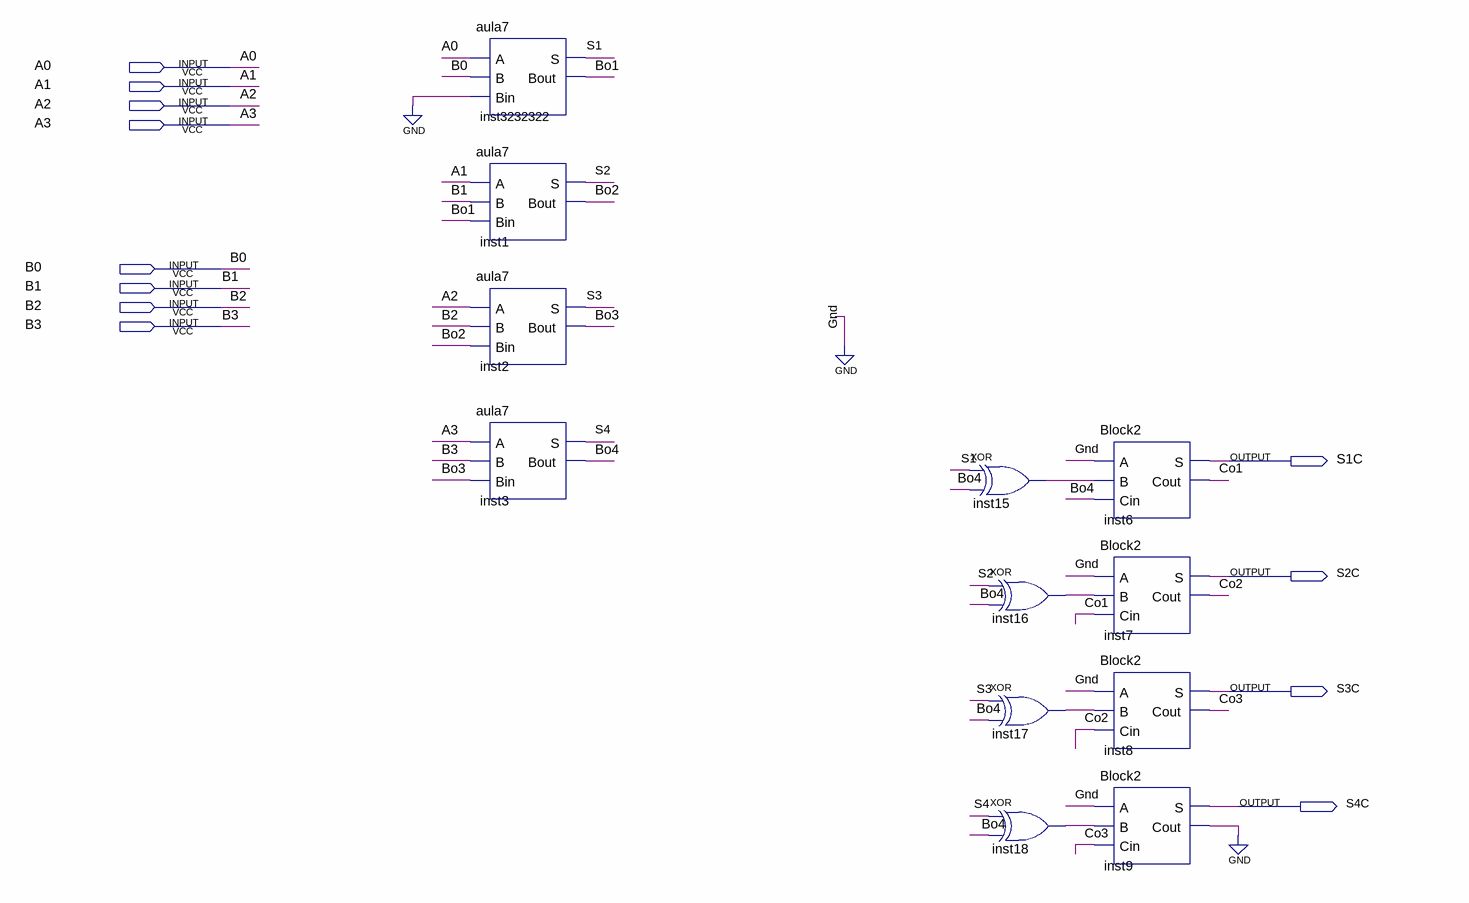
[diagram p0: schematic sheet]
// Quartus schematic aula8.bdf as structural Verilog: 12 symbols, 12 pins
module aula8 (
  input  A0,
  input  A1,
  input  A2,
  input  A3,
  input  B0,
  input  B1,
  input  B2,
  input  B3,
  output S1C,
  output S2C,
  output S3C,
  output S4C
);

  wire Bo1, Bo2, Bo3, Bo4, Co1, Co2, Co3, inst9_cout, inst15_out, inst16_out, inst17_out, inst18_out, S1, S2,
       S3, S4;

  aula7 inst3232322 (.A(A0), .B(B0), .Bin(1'b0), .S(S1), .Bout(Bo1));
  aula7 inst1 (.A(A1), .B(B1), .Bin(Bo1), .S(S2), .Bout(Bo2));
  aula7 inst2 (.A(A2), .B(B2), .Bin(Bo2), .S(S3), .Bout(Bo3));
  aula7 inst3 (.A(A3), .B(B3), .Bin(Bo3), .S(S4), .Bout(Bo4));
  xor inst15 (inst15_out, S1, Bo4);
  xor inst16 (inst16_out, S2, Bo4);
  xor inst17 (inst17_out, S3, Bo4);
  xor inst18 (inst18_out, S4, Bo4);
  Block2 inst6 (.A(1'b0), .B(inst15_out), .Cin(Bo4), .S(S1C), .Cout(Co1));
  Block2 inst7 (.A(1'b0), .B(inst16_out), .Cin(Co1), .S(S2C), .Cout(Co2));
  Block2 inst8 (.A(1'b0), .B(inst17_out), .Cin(Co2), .S(S3C), .Cout(Co3));
  Block2 inst9 (.A(1'b0), .B(inst18_out), .Cin(Co3), .S(S4C), .Cout(inst9_cout));
  // also tied to GND on the sheet: inst9_cout
endmodule
